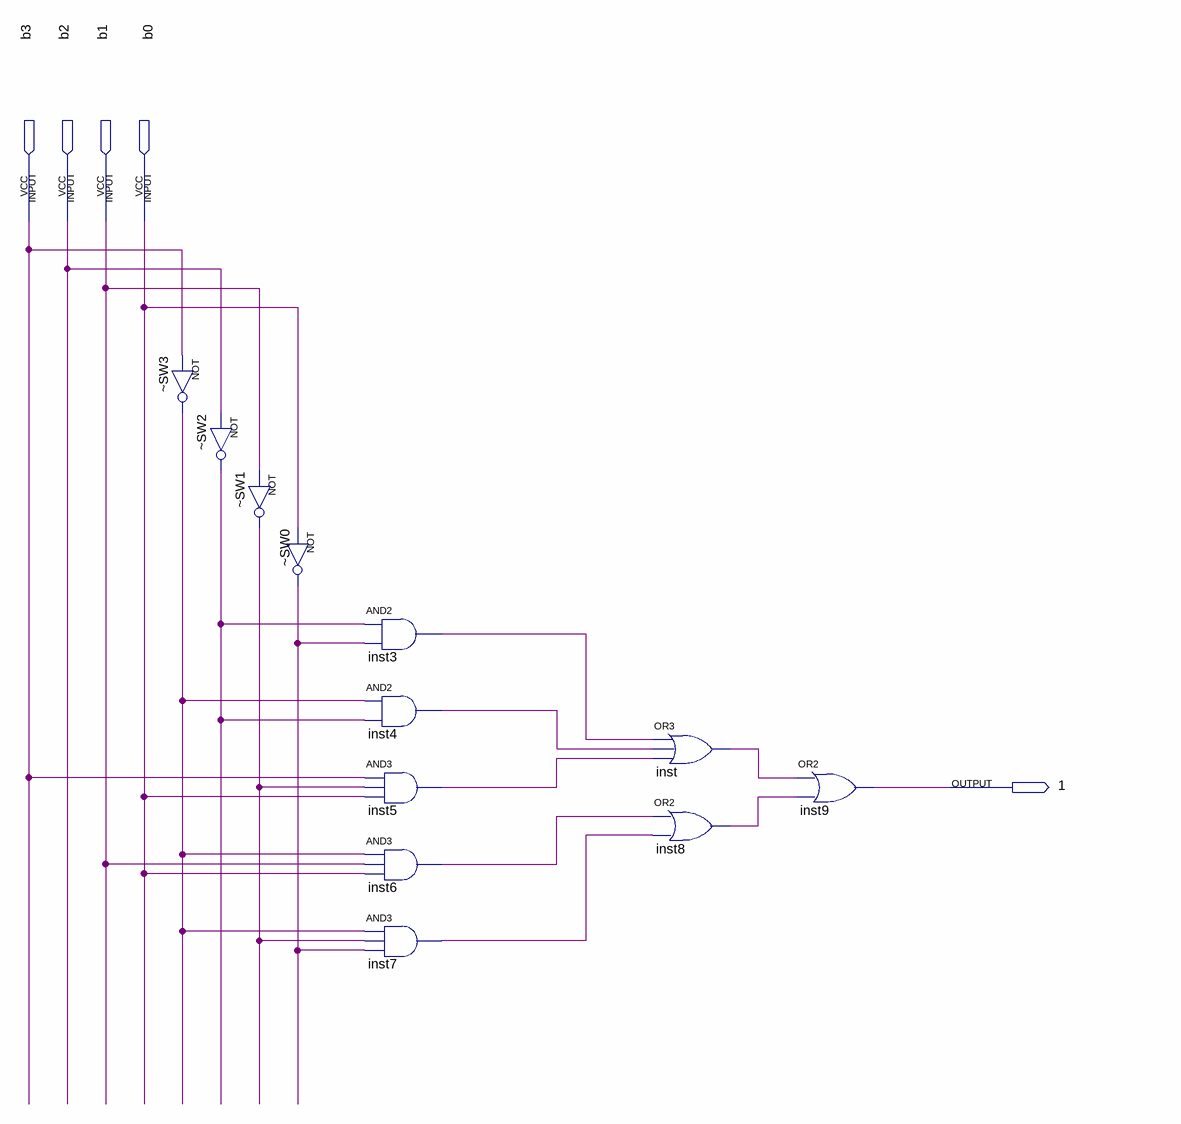
[diagram p0: schematic sheet]
// Quartus schematic 1.bdf as structural Verilog: 12 symbols, 5 pins
module \1  (
  input  b3,
  input  b2,
  input  b1,
  input  b0,
  output \1 
);

  wire _SW0_out, _SW1_out, _SW2_out, _SW3_out, inst3_out, inst4_out, inst5_out, inst6_out, inst7_out,
       inst8_out, inst_out;

  not \u_~SW3  (_SW3_out, b3);
  not \u_~SW2  (_SW2_out, b2);
  not \u_~SW1  (_SW1_out, b1);
  not \u_~SW0  (_SW0_out, b0);
  and inst3 (inst3_out, _SW2_out, _SW0_out);
  and inst4 (inst4_out, _SW3_out, _SW2_out);
  and inst5 (inst5_out, b3, _SW1_out, b0);
  and inst6 (inst6_out, _SW3_out, b1, b0);
  and inst7 (inst7_out, _SW3_out, _SW1_out, _SW0_out);
  or inst (inst_out, inst3_out, inst4_out, inst5_out);
  or inst8 (inst8_out, inst6_out, inst7_out);
  or inst9 (\1 , inst_out, inst8_out);
endmodule
